# Altium schematic sheet ServoMotor.SchDoc
size A4; SheetNumber: 7
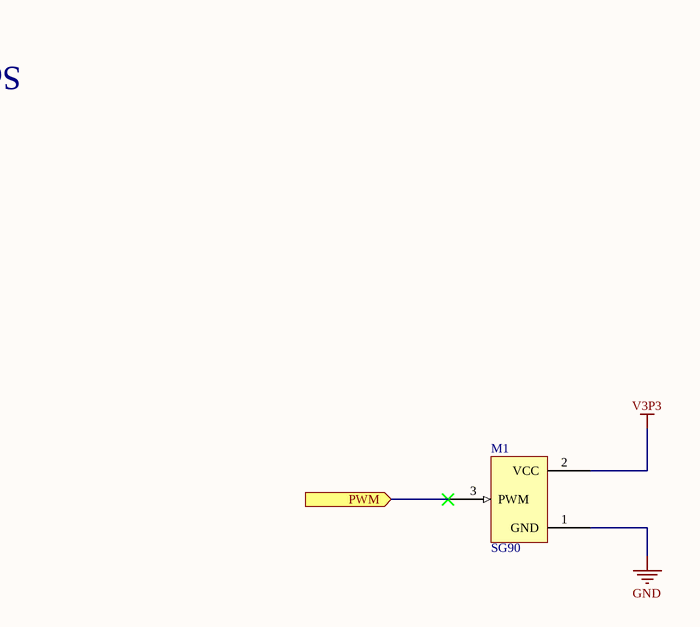
[diagram p0: ServoMotor.SchDoc]

## Parts
M1  SG90  [C-Grid III x3]

## Ports
PWM (in)

## Nets
GND: M1.1(GND)
V3P3: M1.2(VCC)
PWM: M1.3(PWM) ; port PWM

## Notes on the sheet
- Servomotor

## Library data of the parts
M1 = SG90: Servo motor; Fabricant: Molex; Fournisseur: Farnell; RefFournisseur: 9731156; RefFabricant: 22-27-2031